# EAGLE schematic NewWiring (EAGLE 7.7.0)
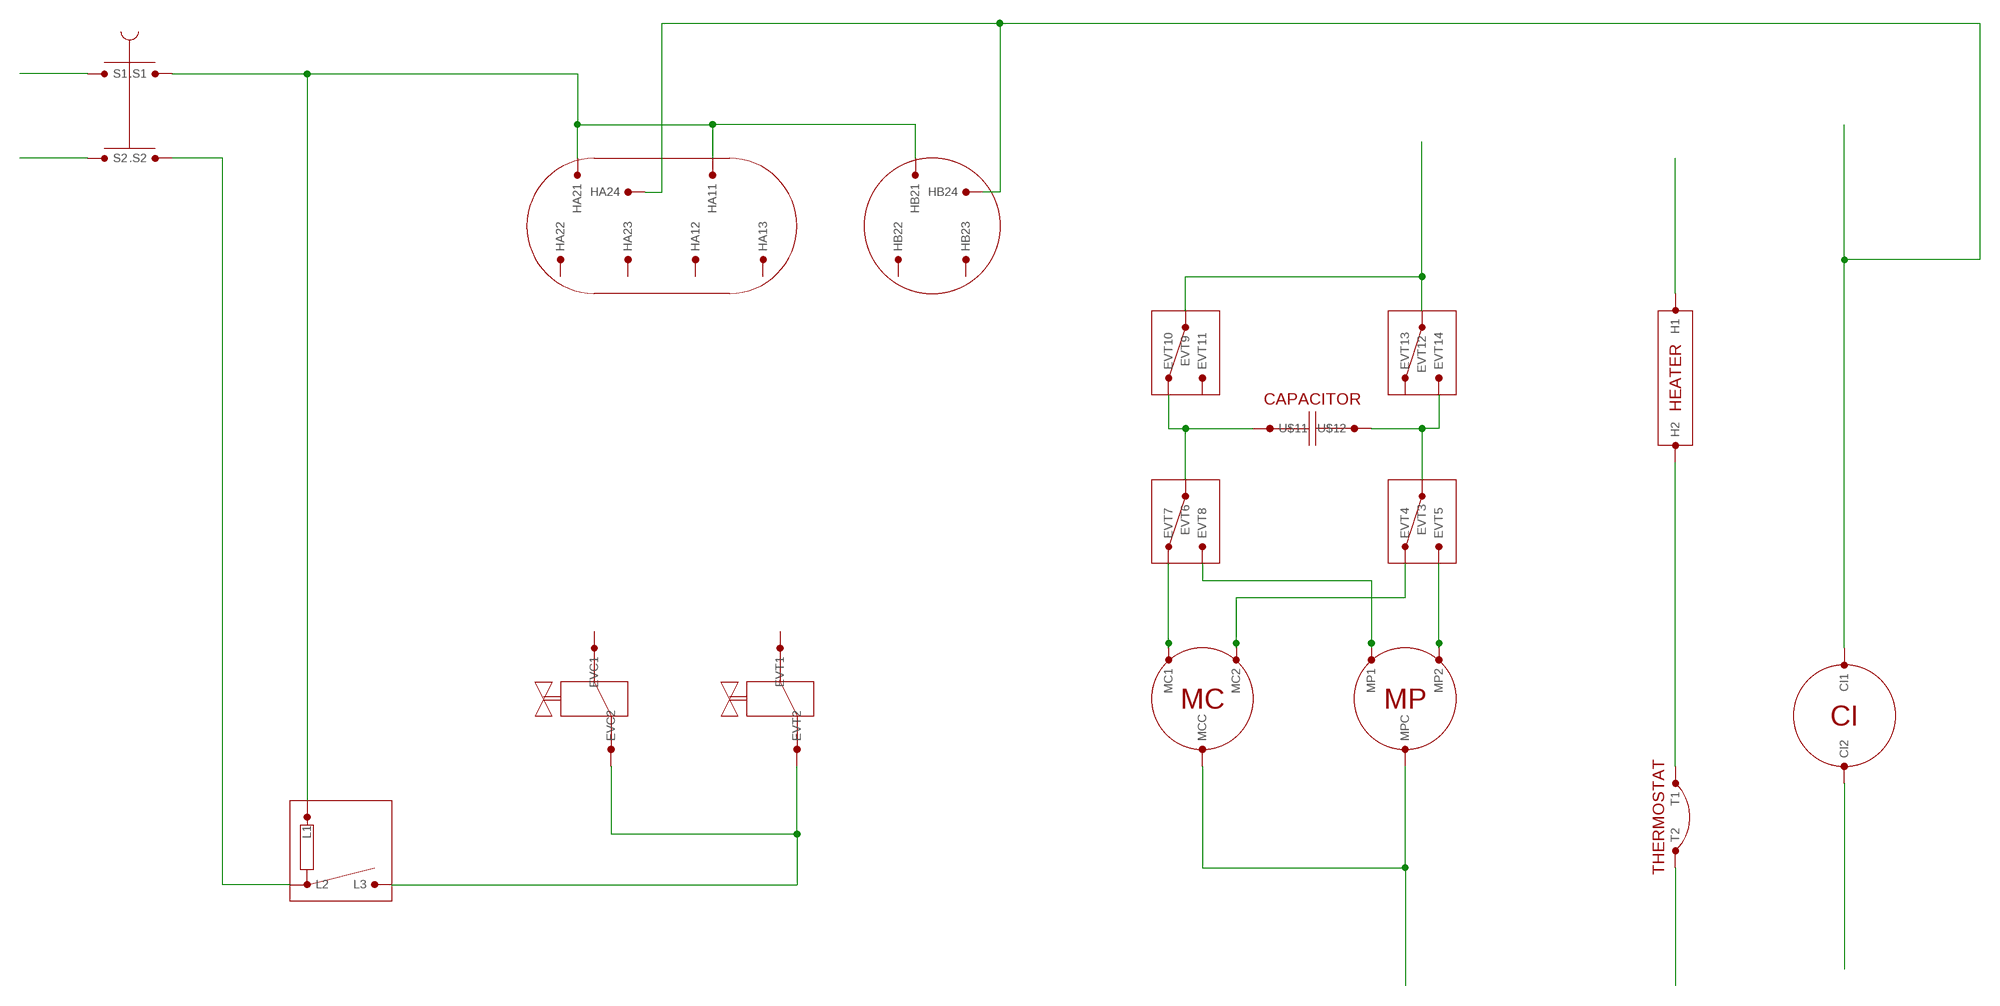
[diagram p0: schematic, sheet 1]

## Parts
.S1  PIN  [PIN]
.S2  PIN  [PIN]
CI1  PIN  [PIN]
CI2  PIN  [PIN]
EVC1  PIN  [PIN]
EVC2  PIN  [PIN]
EVT1  PIN  [PIN]
EVT2  PIN  [PIN]
EVT3  PIN  [PIN]
EVT4  PIN  [PIN]
EVT5  PIN  [PIN]
EVT6  PIN  [PIN]
EVT7  PIN  [PIN]
EVT8  PIN  [PIN]
EVT9  PIN  [PIN]
EVT10  PIN  [PIN]
EVT11  PIN  [PIN]
EVT12  PIN  [PIN]
EVT13  PIN  [PIN]
EVT14  PIN  [PIN]
H1  PIN  [PIN]
H2  PIN  [PIN]
HA11  PIN  [PIN]
HA12  PIN  [PIN]
HA13  PIN  [PIN]
HA21  PIN  [PIN]
HA22  PIN  [PIN]
HA23  PIN  [PIN]
HA24  PIN  [PIN]
HB21  PIN  [PIN]
HB22  PIN  [PIN]
HB23  PIN  [PIN]
HB24  PIN  [PIN]
L1  PIN  [PIN]
L2  PIN  [PIN]
L3  PIN  [PIN]
MC1  PIN  [PIN]
MC2  PIN  [PIN]
MCC  PIN  [PIN]
MP1  PIN  [PIN]
MP2  PIN  [PIN]
MPC  PIN  [PIN]
S1  PIN  [PIN]
S2  PIN  [PIN]
T1  PIN  [PIN]
T2  PIN  [PIN]
U$11  PIN  [PIN]
U$12  PIN  [PIN]

## Nets
N$1: .S1.P$1(PIN1) HA11.P$1(PIN1) HA21.P$1(PIN1) HB21.P$1(PIN1) L1.P$1(PIN1)
N$2: EVC2.P$1(PIN1) EVT2.P$1(PIN1) L3.P$1(PIN1)
N$3: .S2.P$1(PIN1) L2.P$1(PIN1)
N$4: MCC.P$1(PIN1) MPC.P$1(PIN1)
N$5: H2.P$1(PIN1) T1.P$1(PIN1)
N$6: T2.P$1(PIN1)
N$7: CI2.P$1(PIN1)
N$8: S1.P$1(PIN1)
N$9: H1.P$1(PIN1)
N$10: S2.P$1(PIN1)
N$11: EVT7.P$1(PIN1) MC1.P$1(PIN1)
N$12: EVT8.P$1(PIN1) MP1.P$1(PIN1)
N$13: EVT5.P$1(PIN1) MP2.P$1(PIN1)
N$14: EVT4.P$1(PIN1) MC2.P$1(PIN1)
N$15: EVT3.P$1(PIN1) EVT14.P$1(PIN1) U$12.P$1(PIN1)
N$16: EVT6.P$1(PIN1) EVT10.P$1(PIN1) U$11.P$1(PIN1)
N$19: EVT9.P$1(PIN1) EVT12.P$1(PIN1)
OVERFLOW: CI1.P$1(PIN1) HA24.P$1(PIN1) HB24.P$1(PIN1)
Unconnected: EVC1.P$1(PIN1) EVT1.P$1(PIN1) EVT11.P$1(PIN1) EVT13.P$1(PIN1) HA12.P$1(PIN1) HA13.P$1(PIN1) HA22.P$1(PIN1) HA23.P$1(PIN1) HB22.P$1(PIN1) HB23.P$1(PIN1)

## Notes on the sheet
- HEATER
- CAPACITOR
- MC | MP
- CI
- THERMOSTAT

## Library data of the parts
.S1 .S2 CI1 CI2 EVC1 EVC2 EVT1-EVT14 H1 H2 HA11-HA13 HA21-HA24 HB21-HB24 L1-L3 MC1 MC2 MCC MP1 MP2 MPC S1 S2 T1 T2 U$11 U$12 = Connectors:PIN: SINGLE PIN